# Altium schematic sheet JTAG.SchDoc: JTAG
size 279 x 215 mm; CheckedBy: Lance Bantoto; Engineer: Cindy Li; DocumentNumber: 23; Revision: 1; SheetNumber: 23; SheetTotal: 23
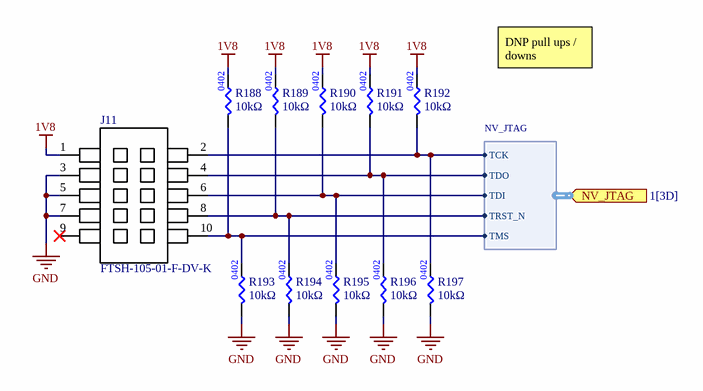
[diagram p0: JTAG.SchDoc]

## Parts
J11  Manufacturer Part Number 1: FTSH-105-01-F-DV-K  [FTSH-105-01-F-DV-K-P-TR]  (hidden comment: CON_PROGRAMMING)
R188  Resistance: 10kΩ  [RES0402]  (hidden comment: RES_10kΩ_0402_1%)
R189  Resistance: 10kΩ  [RES0402]  (hidden comment: RES_10kΩ_0402_1%)
R190  Resistance: 10kΩ  [RES0402]  (hidden comment: RES_10kΩ_0402_1%)
R191  Resistance: 10kΩ  [RES0402]  (hidden comment: RES_10kΩ_0402_1%)
R192  Resistance: 10kΩ  [RES0402]  (hidden comment: RES_10kΩ_0402_1%)
R193  Resistance: 10kΩ  [RES0402]  (hidden comment: RES_10kΩ_0402_1%)
R194  Resistance: 10kΩ  [RES0402]  (hidden comment: RES_10kΩ_0402_1%)
R195  Resistance: 10kΩ  [RES0402]  (hidden comment: RES_10kΩ_0402_1%)
R196  Resistance: 10kΩ  [RES0402]  (hidden comment: RES_10kΩ_0402_1%)
R197  Resistance: 10kΩ  [RES0402]  (hidden comment: RES_10kΩ_0402_1%)

## Ports
NV_JTAG (in, harness NV_JTAG, see 1[3D])

## Harnesses
NV_JTAG: TCK, TDI, TDO, TMS, TRST_N

## Nets
1V8: J11.1 R188.2 R189.2 R190.2 R191.2 R192.2
GND: J11.3 J11.5 J11.7 R193.1 R194.1 R195.1 R196.1 R197.1
NetJ11_2: J11.2 R192.1 R197.2 ; port NV_JTAG.TCK
NetJ11_4: J11.4 R191.1 R196.2 ; port NV_JTAG.TDO
NetJ11_6: J11.6 R190.1 R195.2 ; port NV_JTAG.TDI
NetJ11_8: J11.8 R189.1 R194.2 ; port NV_JTAG.TRST_N
NetJ11_10: J11.10 R188.1 R193.2 ; port NV_JTAG.TMS

Not connected (* = marked no-connect by the designer): J11 9*

## Notes on the sheet
- DNP pull ups / downs
- University of Waterloo Robotics Team
- 200 University Ave W
- REV
- PROJECT
- Waterloo, Ontario, Canada
- N2L 3G1
- DOCUMENT
- ENGINEER
- REVIEWER
- MODIFIED
- SHEET
- OF

## Library data of the parts
J11 = CON_PROGRAMMING: CONN HEADER SMD 10POS 1.27MM; Manufacturer 1: Samtec; Supplier 1: Digi-Key; Pitch: 1.27mm; Supplier Part Number 1: SAM8796-ND; Mounting Type: SMD
R188-R197 = RES_10kΩ_0402_1%: RES 10K OHM 1% 1/16W 0402; Manufacturer 1: Samsung Electro-Mechanics; Manufacturer Part Number 1: RC1005F103CS; Supplier Part Number 1: 1276-3431-1-ND; Supplier 1: Digi-Key; Tolerance: 1%; Package: 0402